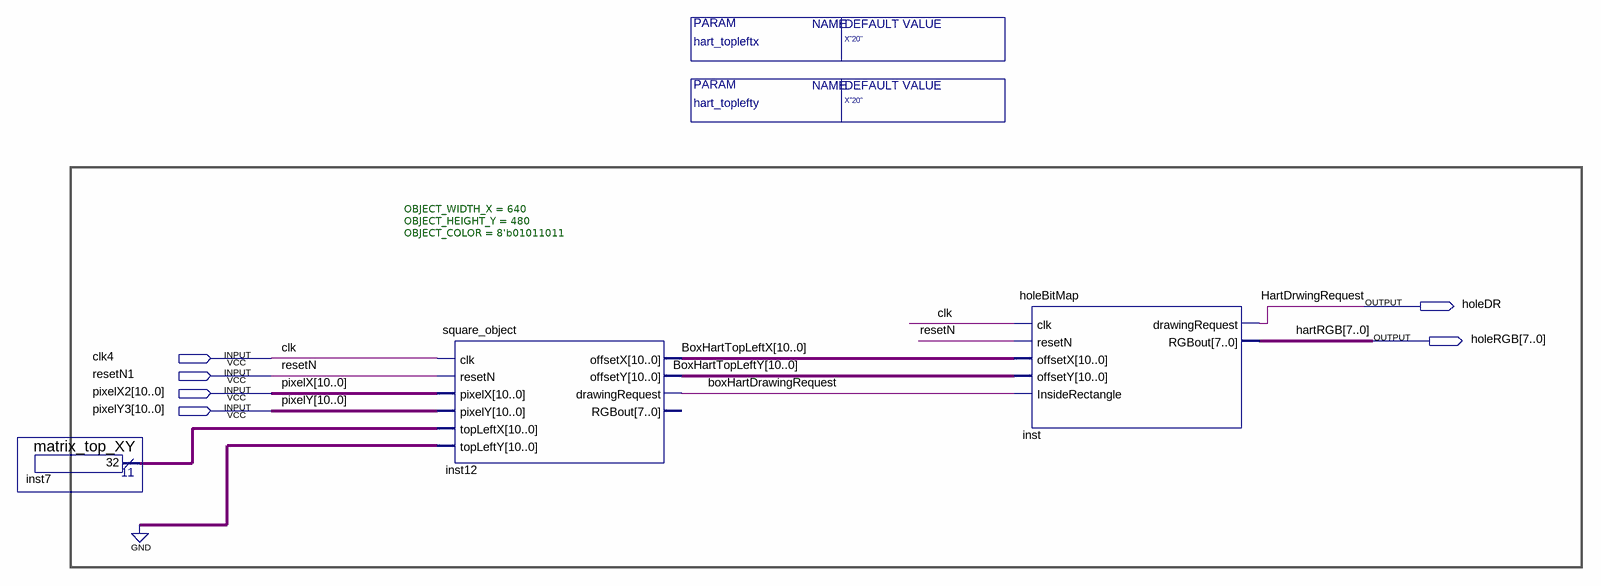
[diagram p0: schematic sheet]
// Quartus schematic holeDisplay.bdf as structural Verilog: 3 symbols, 6 pins
module holeDisplay #(parameter hart_topleftx = "X\"20\"", parameter hart_toplefty = "X\"20\"") (
  input  clk4,
  input  resetN1,
  input  [10:0] pixelX2,
  input  [10:0] pixelY3,
  output holeDR,
  output [7:0] holeRGB
);

  wire boxHartDrawingRequest;
  wire [10:0] BoxHartTopLeftX, BoxHartTopLeftY, inst7_result;

  matrix_top_XY inst7 (.result(inst7_result));
  square_object #(.OBJECT_WIDTH_X(640), .OBJECT_HEIGHT_Y(480), .OBJECT_COLOR(8'b01011011)) inst12 (
    .clk(clk4), .resetN(resetN1), .pixelX(pixelX2), .pixelY(pixelY3), .topLeftX(inst7_result),
    .topLeftY({11{1'b0}}), .offsetX(BoxHartTopLeftX), .offsetY(BoxHartTopLeftY),
    .drawingRequest(boxHartDrawingRequest));  // open: RGBout
  holeBitMap inst (
    .clk(clk4), .resetN(resetN1), .offsetX(BoxHartTopLeftX), .offsetY(BoxHartTopLeftY),
    .InsideRectangle(boxHartDrawingRequest), .drawingRequest(holeDR), .RGBout(holeRGB));

  // Other names for the same wires on the sheet: clk = clk4; HartDrwingRequest = holeDR; hartRGB[7:0] = holeRGB;
  //   pixelX[10:0] = pixelX2; pixelY[10:0] = pixelY3; resetN = resetN1
endmodule
